# Altium schematic sheet MCU.SchDoc
size A4; SheetNumber: 1; SheetTotal: 2
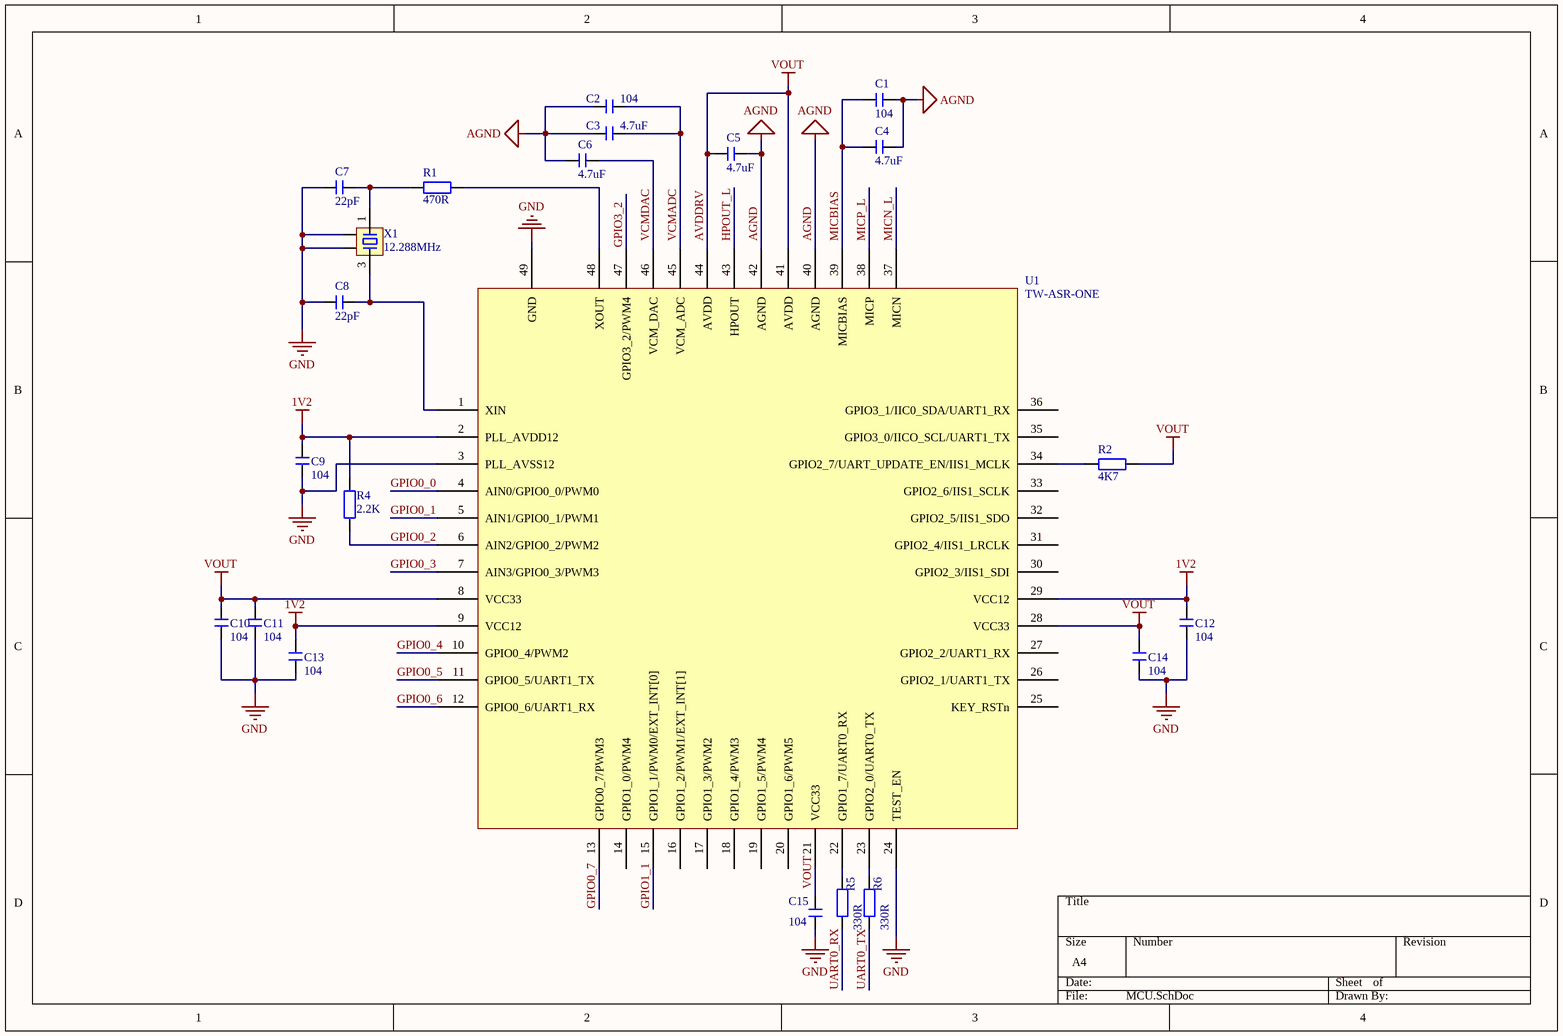
[diagram p0: MCU.SchDoc]

## Parts
C1  104  [C 0603_L]
C2  104  [C 0603_L]
C3  4.7uF  [C 0603_L]
C4  4.7uF  [C 0603_L]
C5  4.7uF  [C 0603_L]
C6  4.7uF  [C 0603_L]
C7  22pF  [C 0603_L]
C8  22pF  [C 0603_L]
C9  104  [C 0603_L]
C10  104  [C 0603_L]
C11  104  [C 0603_L]
C12  104  [C 0603_L]
C13  104  [C 0603_L]
C14  104  [C 0603_L]
C15  104  [C 0603_L]
R1  470R  [R 0603_L]
R2  4K7  [R 0603_L]
R4  2.2K  [R 0603_L]
R5  330R  [R 0603_L]
R6  330R  [R 0603_L]
U1  TW-ASR-ONE  [QFN48 6X6]
X1  12.288MHz  [OSC 3225-4P]

## Nets
1V2: C9.2 C12.2 C13.2 R4.2 U1.2(PLL_AVDD12) U1.9(VCC12) U1.29(VCC12)
AGND: C1.2 C2.1 C3.1 C4.2 C5.2 C6.1 U1.40(AGND) U1.42(AGND)
AVDDRV: C5.1 C10.2 C11.2 C14.2 C15.2 R2.2 U1.8(VCC33) U1.21(VCC33) U1.28(VCC33) U1.41(AVDD) U1.44(AVDD)  [also labelled VOUT]
GND: C7.1 C8.1 C9.1 C10.1 C11.1 C12.1 C13.1 C14.1 C15.1 U1.3(PLL_AVSS12) U1.24(TEST_EN) U1.49(GND) X1.2 X1.4
GPIO0_0: U1.4(AIN0/GPIO0_0/PWM0)
GPIO0_1: U1.5(AIN1/GPIO0_1/PWM1)
GPIO0_2: R4.1 U1.6(AIN2/GPIO0_2/PWM2)
GPIO0_3: U1.7(AIN3/GPIO0_3/PWM3)
GPIO0_4: U1.10(GPIO0_4/PWM2)
GPIO0_5: U1.11(GPIO0_5/UART1_TX)
GPIO0_6: U1.12(GPIO0_6/UART1_RX)
GPIO0_7: U1.13(GPIO0_7/PWM3)
GPIO1_1: U1.15(GPIO1_1/PWM0/EXT_INT[0])
GPIO3_2: U1.47(GPIO3_2/PWM4)
HPOUT_L: U1.43(HPOUT)
MICBIAS: C1.1 C4.1 U1.39(MICBIAS)
MICN_L: U1.37(MICN)
MICP_L: U1.38(MICP)
UART0_RX: R5.1
UART0_TX: R6.1
VCMADC: C2.2 C3.2 U1.45(VCM_ADC)
VCMDAC: C6.2 U1.46(VCM_DAC)
NetC7_2: C7.2 R1.1 X1.1
NetC8_2: C8.2 U1.1(XIN) X1.3
NetR1_2: R1.2 U1.48(XOUT)
NetR2_1: R2.1 U1.34(GPIO2_7/UART_UPDATE_EN/IIS1_MCLK)
NetR5_2: R5.2 U1.22(GPIO1_7/UART0_RX)
NetR6_2: R6.2 U1.23(GPIO2_0/UART0_TX)

Not connected (* = marked no-connect by the designer): U1 14(GPIO1_0/PWM4) 16(GPIO1_2/PWM1/EXT_INT[1]) 17(GPIO1_3/PWM2) 18(GPIO1_4/PWM3) 19(GPIO1_5/PWM4) 20(GPIO1_6/PWM5) 25(KEY_RSTn) 26(GPIO2_1/UART1_TX) 27(GPIO2_2/UART1_RX) 30(GPIO2_3/IIS1_SDI) 31(GPIO2_4/IIS1_LRCLK) 32(GPIO2_5/IIS1_SDO) 33(GPIO2_6/IIS1_SCLK) 35(GPIO3_0/IICO_SCL/UART1_TX) 36(GPIO3_1/IIC0_SDA/UART1_RX)

## Library data of the parts
C1-C15 = C: 无极性贴片电容; 版权归属: 源创客; BOM名称: 无极性贴片电容; 学习资源: www.ooocke.com
R1 R2 R4-R6 = R: 贴片电阻; 版权归属: 源创客; BOM名称: 贴片电阻; 学习资源: www.ooocke.com
X1 = XTAL-4P: 4脚无源晶振; 版权归属: 源创客; BOM名称: 4脚无源晶振; 学习资源: www.ooocke.com